# Altium schematic sheet AudioDSP-v3.0.0c_top.SchDoc
size A3; SheetNumber: 1; SheetTotal: 13
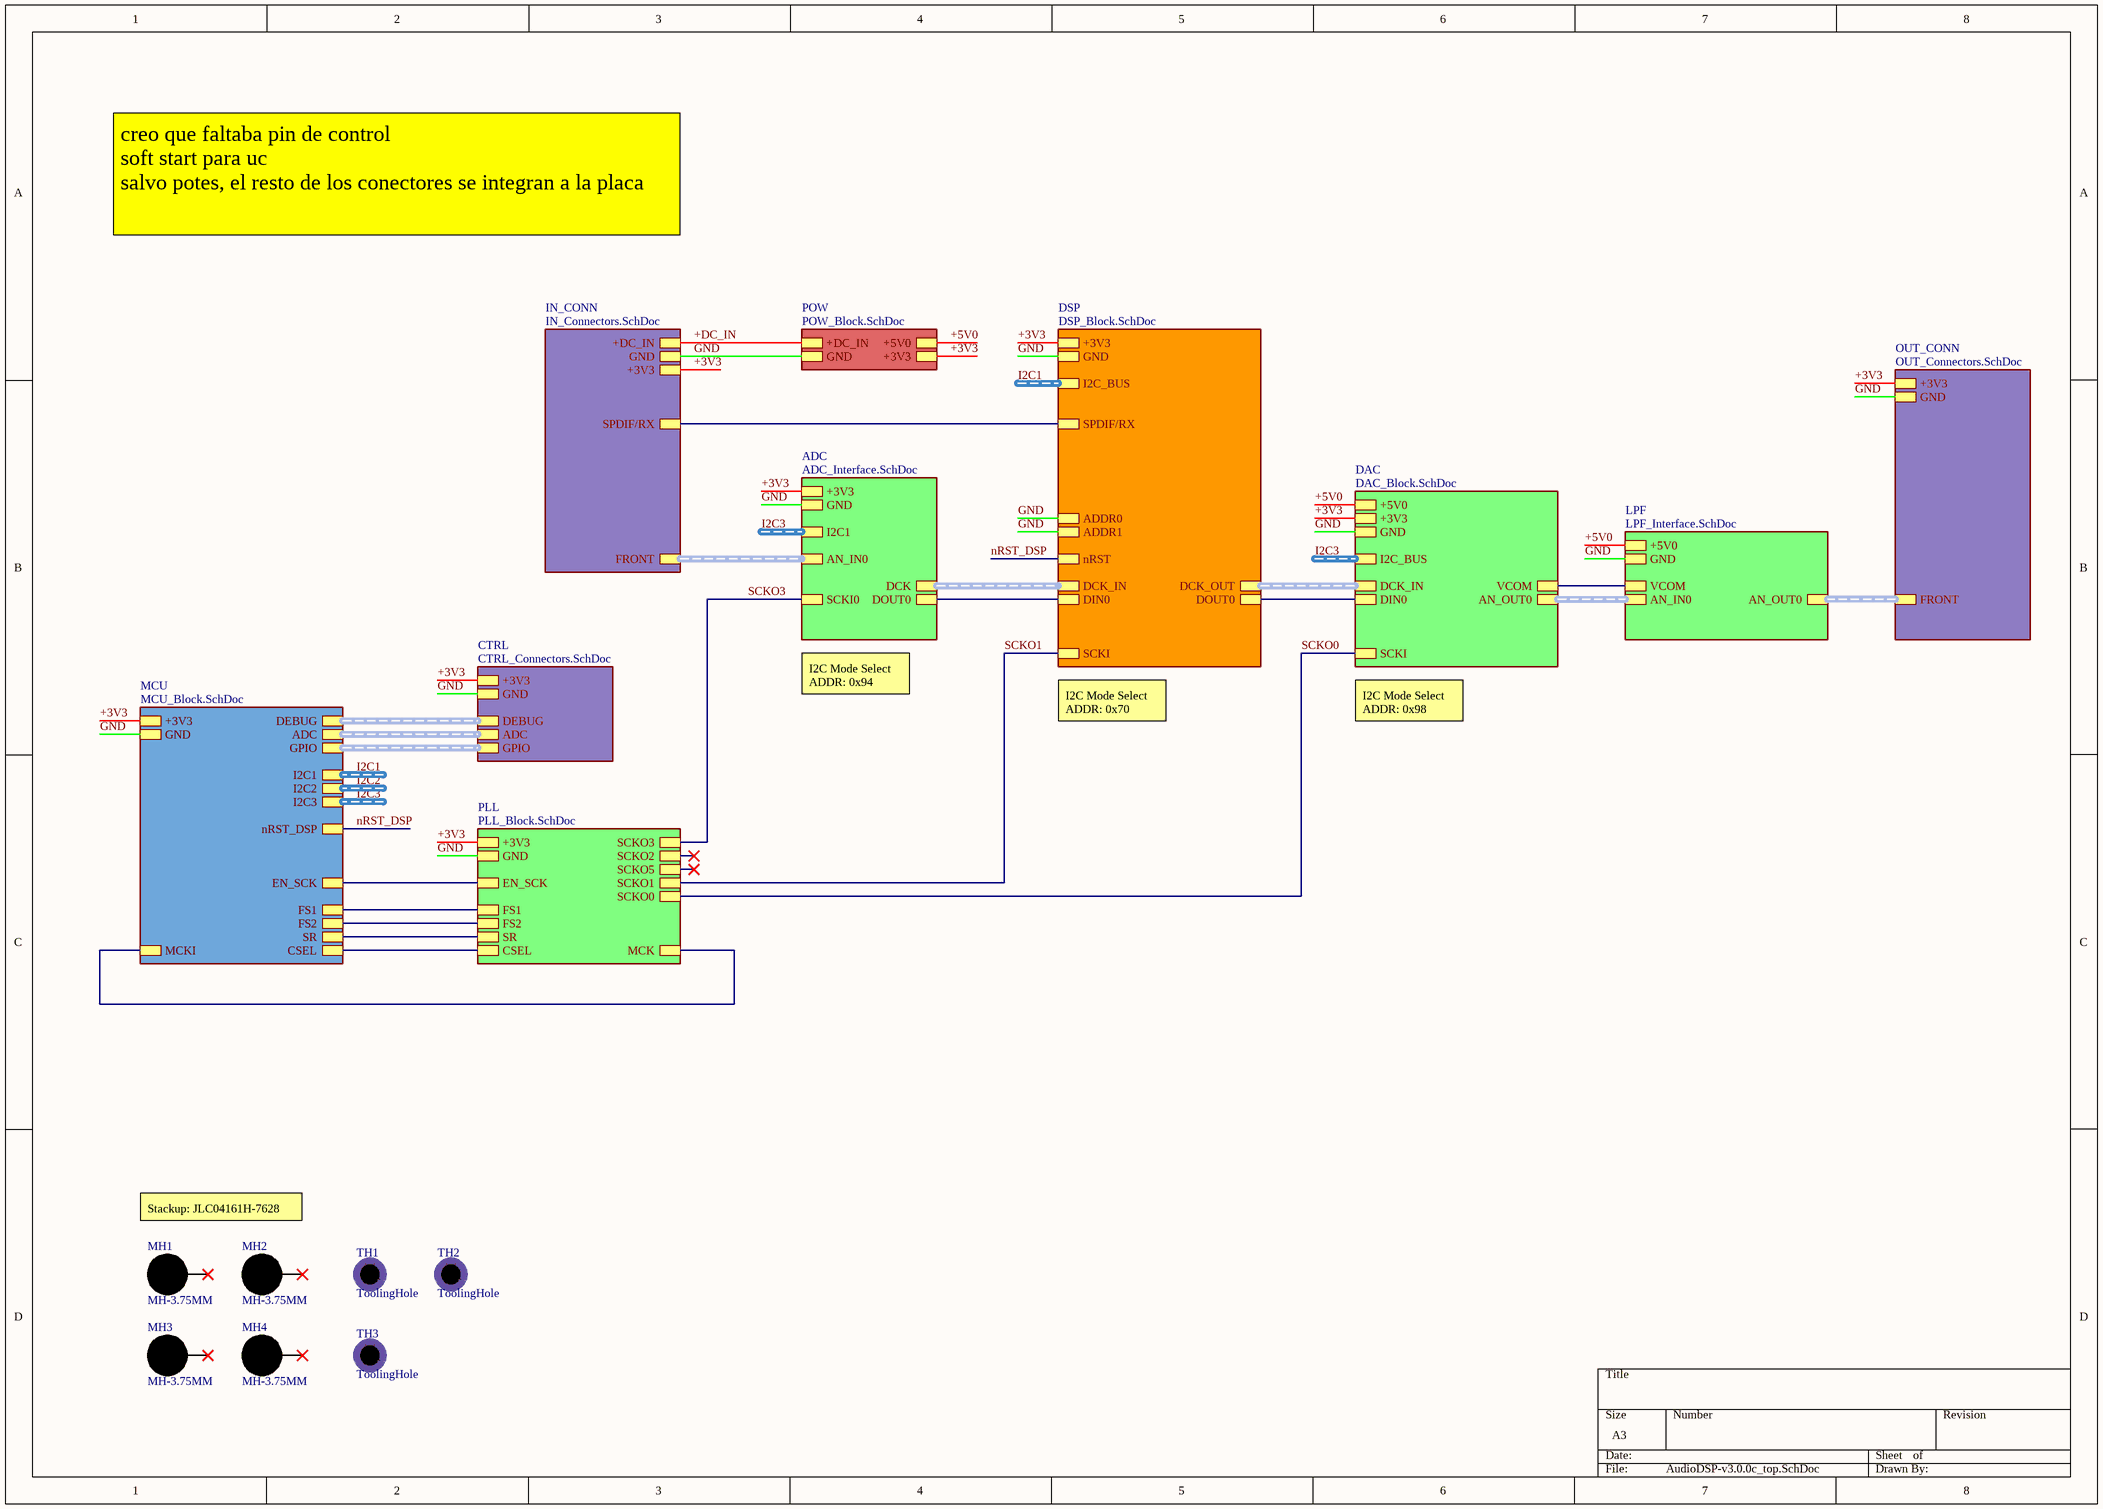
[diagram p0: AudioDSP-v3.0.0c_top.SchDoc]

## Parts
MH1  MH-3.75MM  [MH-3.75mm-NP]  (no BOM)
MH2  MH-3.75MM  [MH-3.75mm-NP]  (no BOM)
MH3  MH-3.75MM  [MH-3.75mm-NP]  (no BOM)
MH4  MH-3.75MM  [MH-3.75mm-NP]  (no BOM)
TH1  ToolingHole  [TOOLING-HOLE]  (no BOM)
TH2  ToolingHole  [TOOLING-HOLE]  (no BOM)
TH3  ToolingHole  [TOOLING-HOLE]  (no BOM)

## Sub-sheets
ADC = ADC_Interface.SchDoc: +3V3, GND, I2C1 (harness I2C), SCKI0, AN_IN0 (harness AN), DCK (harness DCK), DOUT0
CTRL = CTRL_Connectors.SchDoc: DEBUG (harness SW), +3V3, GND, ADC (harness ADC), GPIO (harness GPIO)
DAC = DAC_Block.SchDoc: +3V3, GND, I2C_BUS (harness I2C), +5V0, VCOM, DIN0, DCK_IN (harness DCK), SCKI, AN_OUT0 (harness AN)
DSP = DSP_Block.SchDoc: +3V3, GND, SCKI, nRST, ADDR0, ADDR1, I2C_BUS (harness I2C), DCK_IN (harness DCK), DIN0, DCK_OUT (harness DCK), DOUT0, SPDIF/RX
IN_CONN = IN_Connectors.SchDoc: +DC_IN, GND, FRONT (harness AN), +3V3, SPDIF/RX
LPF = LPF_Interface.SchDoc: +5V0, GND, VCOM, AN_IN0 (harness AN), AN_OUT0 (harness AN)
MCU = MCU_Block.SchDoc: +3V3, GND, DEBUG (harness SW), ADC (harness ADC), I2C1 (harness I2C), I2C2 (harness I2C), I2C3 (harness I2C), MCKI, nRST_DSP, EN_SCK, FS1, FS2, SR, CSEL, GPIO (harness GPIO)
OUT_CONN = OUT_Connectors.SchDoc: FRONT (harness AN), GND, +3V3
PLL = PLL_Block.SchDoc: +3V3, GND, FS1, FS2, SR, CSEL, MCK, EN_SCK, SCKO0, SCKO1, SCKO2, SCKO3, SCKO5
POW = POW_Block.SchDoc: +DC_IN, GND, +5V0, +3V3

## Nets
+3V3: sheet PLL/+3V3, sheet DAC/+3V3, sheet POW/+3V3, sheet IN_CONN/+3V3, sheet OUT_CONN/+3V3, sheet MCU/+3V3, sheet CTRL/+3V3, sheet ADC/+3V3, sheet DSP/+3V3
+5V0: sheet DAC/+5V0, sheet POW/+5V0, sheet LPF/+5V0
+DC_IN: sheet POW/+DC_IN, sheet IN_CONN/+DC_IN
GND: sheet PLL/GND, sheet DAC/GND, sheet POW/GND, sheet IN_CONN/GND, sheet OUT_CONN/GND, sheet MCU/GND, sheet CTRL/GND, sheet ADC/GND, sheet LPF/GND, sheet DSP/GND, sheet DSP/ADDR0, sheet DSP/ADDR1
nRST_DSP: sheet MCU/nRST_DSP, sheet DSP/nRST
SCKO0: sheet PLL/SCKO0, sheet DAC/SCKI
SCKO1: sheet PLL/SCKO1, sheet DSP/SCKI
SCKO3: sheet PLL/SCKO3, sheet ADC/SCKI0
(unnamed): sheet PLL/FS1, sheet MCU/FS1
(unnamed): sheet PLL/FS2, sheet MCU/FS2
(unnamed): sheet PLL/SR, sheet MCU/SR
(unnamed): sheet PLL/CSEL, sheet MCU/CSEL
(unnamed): sheet PLL/MCK, sheet MCU/MCKI
(unnamed): sheet PLL/EN_SCK, sheet MCU/EN_SCK
(unnamed): sheet DAC/VCOM, sheet LPF/VCOM
(unnamed): sheet DAC/DIN0, sheet DSP/DOUT0
(unnamed): sheet IN_CONN/SPDIF/RX, sheet DSP/SPDIF/RX
(unnamed): sheet ADC/DOUT0, sheet DSP/DIN0

Not connected (* = marked no-connect by the designer): MH1 1*; MH2 1*; MH3 1*; MH4 1*

## Buses and harness runs
harness I2C1 = sheet DSP/I2C_BUS
harness I2C1 = sheet MCU/I2C1
harness I2C2 = sheet MCU/I2C2
harness I2C3 = sheet ADC/I2C1
harness I2C3 = sheet DAC/I2C_BUS
harness I2C3 = sheet MCU/I2C3
harness sheet ADC/AN_IN0 = sheet IN_CONN/FRONT
harness sheet ADC/DCK = sheet DSP/DCK_IN
harness sheet CTRL/ADC = sheet MCU/ADC
harness sheet CTRL/DEBUG = sheet MCU/DEBUG
harness sheet CTRL/GPIO = sheet MCU/GPIO
harness sheet DAC/AN_OUT0 = sheet LPF/AN_IN0
harness sheet DAC/DCK_IN = sheet DSP/DCK_OUT
harness sheet LPF/AN_OUT0 = sheet OUT_CONN/FRONT

## Notes on the sheet
- creo que faltaba pin de control
  soft start para uc
  salvo potes, el resto de los conectores se integran a la placa
- I2C Mode Select
  ADDR: 0x94
- I2C Mode Select
  ADDR: 0x70
- I2C Mode Select
  ADDR: 0x98
- Stackup: JLC04161H-7628

## Library data of the parts
MH1-MH4 = MH-3.75MM: ClassName: MountHole
TH1-TH3 = ToolingHole: ClassName: Tooling